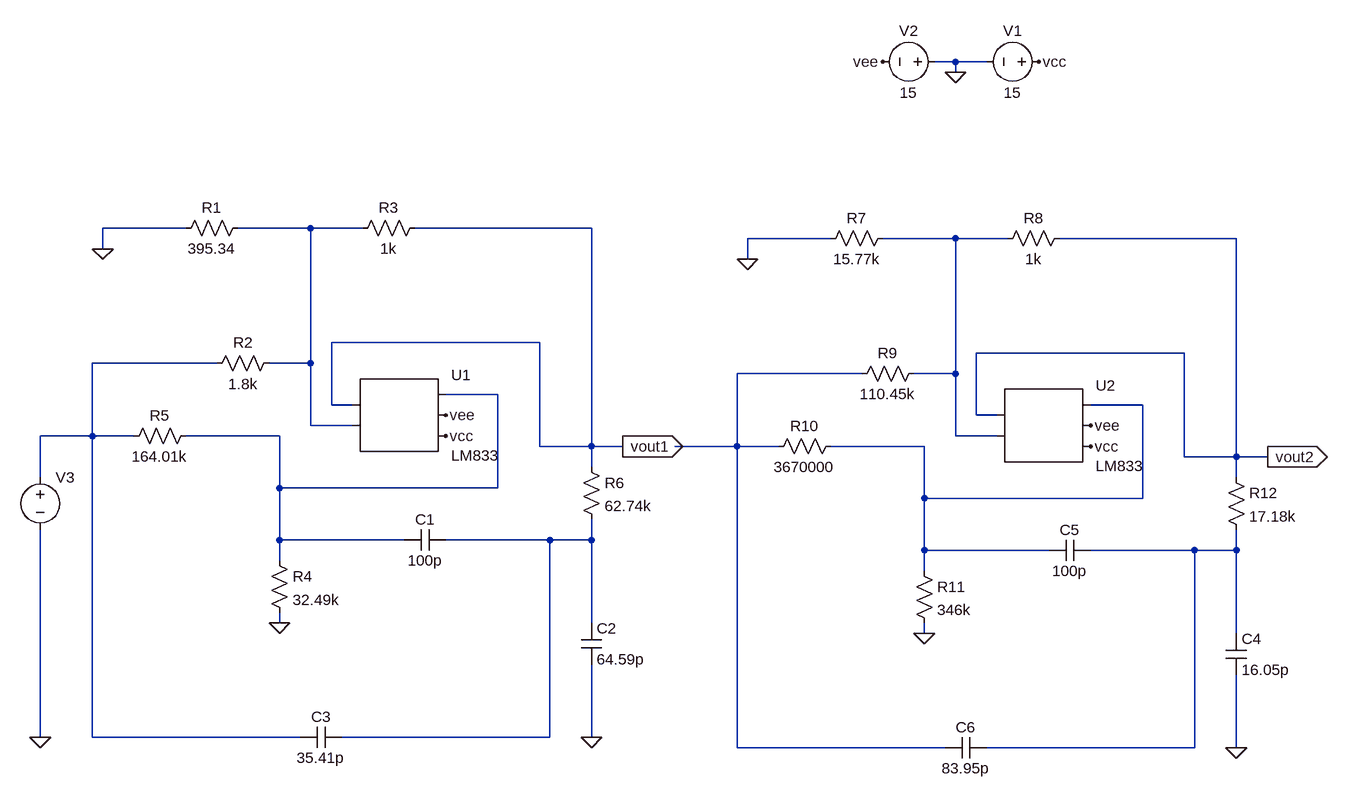
[diagram p0: schematic SGM.asc]
SGM.asc, the LTspice schematic file:
Version 4
SHEET 1 1228 680
WIRE 624 -512 592 -512
WIRE 672 -512 624 -512
WIRE 624 -496 624 -512
WIRE -560 -256 -688 -256
WIRE -368 -256 -480 -256
WIRE -288 -256 -368 -256
WIRE 64 -256 -208 -256
WIRE 432 -240 304 -240
WIRE 624 -240 512 -240
WIRE 704 -240 624 -240
WIRE 1056 -240 784 -240
WIRE -688 -224 -688 -256
WIRE 304 -208 304 -240
WIRE -16 -80 -336 -80
WIRE 976 -64 656 -64
WIRE -512 -48 -704 -48
WIRE -368 -48 -368 -256
WIRE -368 -48 -432 -48
WIRE 480 -32 288 -32
WIRE 624 -32 624 -240
WIRE 624 -32 560 -32
WIRE -80 0 -160 0
WIRE -336 16 -336 -80
WIRE -304 16 -336 16
WIRE 912 16 832 16
WIRE 656 32 656 -64
WIRE 688 32 656 32
WIRE -368 48 -368 -48
WIRE -304 48 -368 48
WIRE -704 64 -704 -48
WIRE -704 64 -784 64
WIRE -640 64 -704 64
WIRE -416 64 -560 64
WIRE 624 64 624 -32
WIRE 688 64 624 64
WIRE -16 80 -16 -80
WIRE 64 80 64 -256
WIRE 64 80 -16 80
WIRE 112 80 64 80
WIRE 288 80 288 -32
WIRE 288 80 192 80
WIRE 352 80 288 80
WIRE 576 80 432 80
WIRE 976 96 976 -64
WIRE 1056 96 1056 -240
WIRE 1056 96 976 96
WIRE 1104 96 1056 96
WIRE 64 112 64 80
WIRE -784 128 -784 64
WIRE 1056 128 1056 96
WIRE -416 144 -416 64
WIRE -80 144 -80 0
WIRE -80 144 -416 144
WIRE 576 160 576 80
WIRE 912 160 912 16
WIRE 912 160 576 160
WIRE -416 224 -416 144
WIRE -224 224 -416 224
WIRE 0 224 -160 224
WIRE 64 224 64 192
WIRE 64 224 0 224
WIRE 576 240 576 160
WIRE 768 240 576 240
WIRE 992 240 832 240
WIRE 1056 240 1056 208
WIRE 1056 240 992 240
WIRE -416 256 -416 224
WIRE 576 272 576 240
WIRE -416 352 -416 336
WIRE 64 352 64 224
WIRE 576 368 576 352
WIRE 1056 368 1056 240
WIRE -784 528 -784 208
WIRE -704 528 -704 64
WIRE -384 528 -704 528
WIRE 0 528 0 224
WIRE 0 528 -320 528
WIRE 64 528 64 416
WIRE 288 544 288 80
WIRE 608 544 288 544
WIRE 992 544 992 240
WIRE 992 544 672 544
WIRE 1056 544 1056 432
FLAG -160 64 vcc
FLAG -160 32 vee
FLAG -688 -224 0
FLAG -416 352 0
FLAG 64 528 0
FLAG 624 -496 0
FLAG 752 -512 vcc
FLAG 512 -512 vee
FLAG -784 528 0
FLAG 112 80 vout1
IOPIN 112 80 Out
FLAG 832 80 vcc
FLAG 832 48 vee
FLAG 304 -208 0
FLAG 576 368 0
FLAG 1056 544 0
FLAG 1104 96 vout2
IOPIN 1104 96 Out
SYMBOL AutoGenerated\\LM833 -240 32 R0
SYMATTR InstName U1
SYMBOL res -464 -272 R90
WINDOW 0 0 56 VBottom 2
WINDOW 3 32 56 VTop 2
SYMATTR InstName R1
SYMATTR Value 395.34
SYMBOL res -192 -272 R90
WINDOW 0 0 56 VBottom 2
WINDOW 3 32 56 VTop 2
SYMATTR InstName R3
SYMATTR Value 1k
SYMBOL res -416 -64 R90
WINDOW 0 0 56 VBottom 2
WINDOW 3 32 56 VTop 2
SYMATTR InstName R2
SYMATTR Value 1.8k
SYMBOL res -544 48 R90
WINDOW 0 0 56 VBottom 2
WINDOW 3 32 56 VTop 2
SYMATTR InstName R5
SYMATTR Value 164.01k
SYMBOL res -432 240 R0
SYMATTR InstName R4
SYMATTR Value 32.49k
SYMBOL res 48 96 R0
SYMATTR InstName R6
SYMATTR Value 62.74k
SYMBOL cap 48 352 R0
SYMATTR InstName C2
SYMATTR Value 64.59p
SYMBOL cap -160 208 R90
WINDOW 0 0 32 VBottom 2
WINDOW 3 32 32 VTop 2
SYMATTR InstName C1
SYMATTR Value 100p
SYMBOL cap -320 512 R90
WINDOW 0 0 32 VBottom 2
WINDOW 3 32 32 VTop 2
SYMATTR InstName C3
SYMATTR Value 35.41p
SYMBOL voltage 768 -512 R90
WINDOW 0 -32 56 VBottom 2
WINDOW 3 32 56 VTop 2
WINDOW 123 0 0 Left 0
WINDOW 39 0 0 Left 0
SYMATTR InstName V1
SYMATTR Value 15
SYMBOL voltage 608 -512 R90
WINDOW 0 -32 56 VBottom 2
WINDOW 3 32 56 VTop 2
WINDOW 123 0 0 Left 0
WINDOW 39 0 0 Left 0
SYMATTR InstName V2
SYMATTR Value 15
SYMBOL voltage -784 112 R0
WINDOW 123 0 0 Left 0
WINDOW 39 0 0 Left 0
SYMATTR InstName V3
SYMATTR Value ""
SYMBOL AutoGenerated\\LM833 752 48 R0
SYMATTR InstName U2
SYMBOL res 528 -256 R90
WINDOW 0 0 56 VBottom 2
WINDOW 3 32 56 VTop 2
SYMATTR InstName R7
SYMATTR Value 15.77k
SYMBOL res 800 -256 R90
WINDOW 0 0 56 VBottom 2
WINDOW 3 32 56 VTop 2
SYMATTR InstName R8
SYMATTR Value 1k
SYMBOL res 576 -48 R90
WINDOW 0 0 56 VBottom 2
WINDOW 3 32 56 VTop 2
SYMATTR InstName R9
SYMATTR Value 110.45k
SYMBOL res 448 64 R90
WINDOW 0 0 56 VBottom 2
WINDOW 3 32 56 VTop 2
SYMATTR InstName R10
SYMATTR Value 3670000
SYMBOL res 560 256 R0
SYMATTR InstName R11
SYMATTR Value 346k
SYMBOL res 1040 112 R0
SYMATTR InstName R12
SYMATTR Value 17.18k
SYMBOL cap 1040 368 R0
SYMATTR InstName C4
SYMATTR Value 16.05p
SYMBOL cap 832 224 R90
WINDOW 0 0 32 VBottom 2
WINDOW 3 32 32 VTop 2
SYMATTR InstName C5
SYMATTR Value 100p
SYMBOL cap 672 528 R90
WINDOW 0 0 32 VBottom 2
WINDOW 3 32 32 VTop 2
SYMATTR InstName C6
SYMATTR Value 83.95p

The netlist it stands for:
* SGM.asc
* U1: LM833 (symbol AutoGenerated\LM833 not available, pins judged from their places): pin1=vout1 pin2=N001 pin3=N005 pin4=vee pin5=vcc
R1 N001 0 395.34
R3 vout1 N001 1k
R2 N001 N003 1.8k
R5 N005 N003 164.01k
R4 N005 0 32.49k
R6 vout1 N007 62.74k
C2 N007 0 64.59p
C1 N007 N005 100p
C3 N007 N003 35.41p
V1 vcc 0 15
V2 0 vee 15
V3 N003 0
* U2: LM833 (symbol AutoGenerated\LM833 not available, pins judged from their places): pin1=vout2 pin2=N002 pin3=N006 pin4=vee pin5=vcc
R7 N002 0 15.77k
R8 vout2 N002 1k
R9 N002 N004 110.45k
R10 N006 N004 3670000
R11 N006 0 346k
R12 vout2 N008 17.18k
C4 N008 0 16.05p
C5 N008 N006 100p
C6 N008 N004 83.95p
.backanno
.end